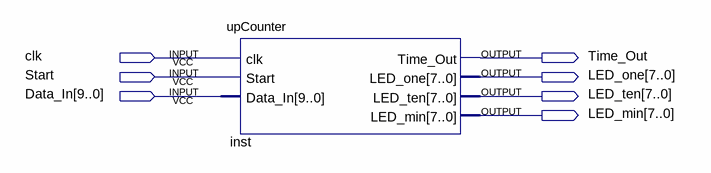
[diagram p0: schematic sheet]
// Quartus schematic lab3.bdf as structural Verilog: 1 symbols, 7 pins
module lab3 (
  input  clk,
  input  Start,
  input  [9:0] Data_In,
  output Time_Out,
  output [7:0] LED_one,
  output [7:0] LED_ten,
  output [7:0] LED_min
);

  upCounter inst (
    .clk(clk), .Start(Start), .Data_In(Data_In), .Time_Out(Time_Out), .LED_one(LED_one), .LED_ten(LED_ten),
    .LED_min(LED_min));
endmodule
